# Altium project Notch-Filter-1.PrjPcb
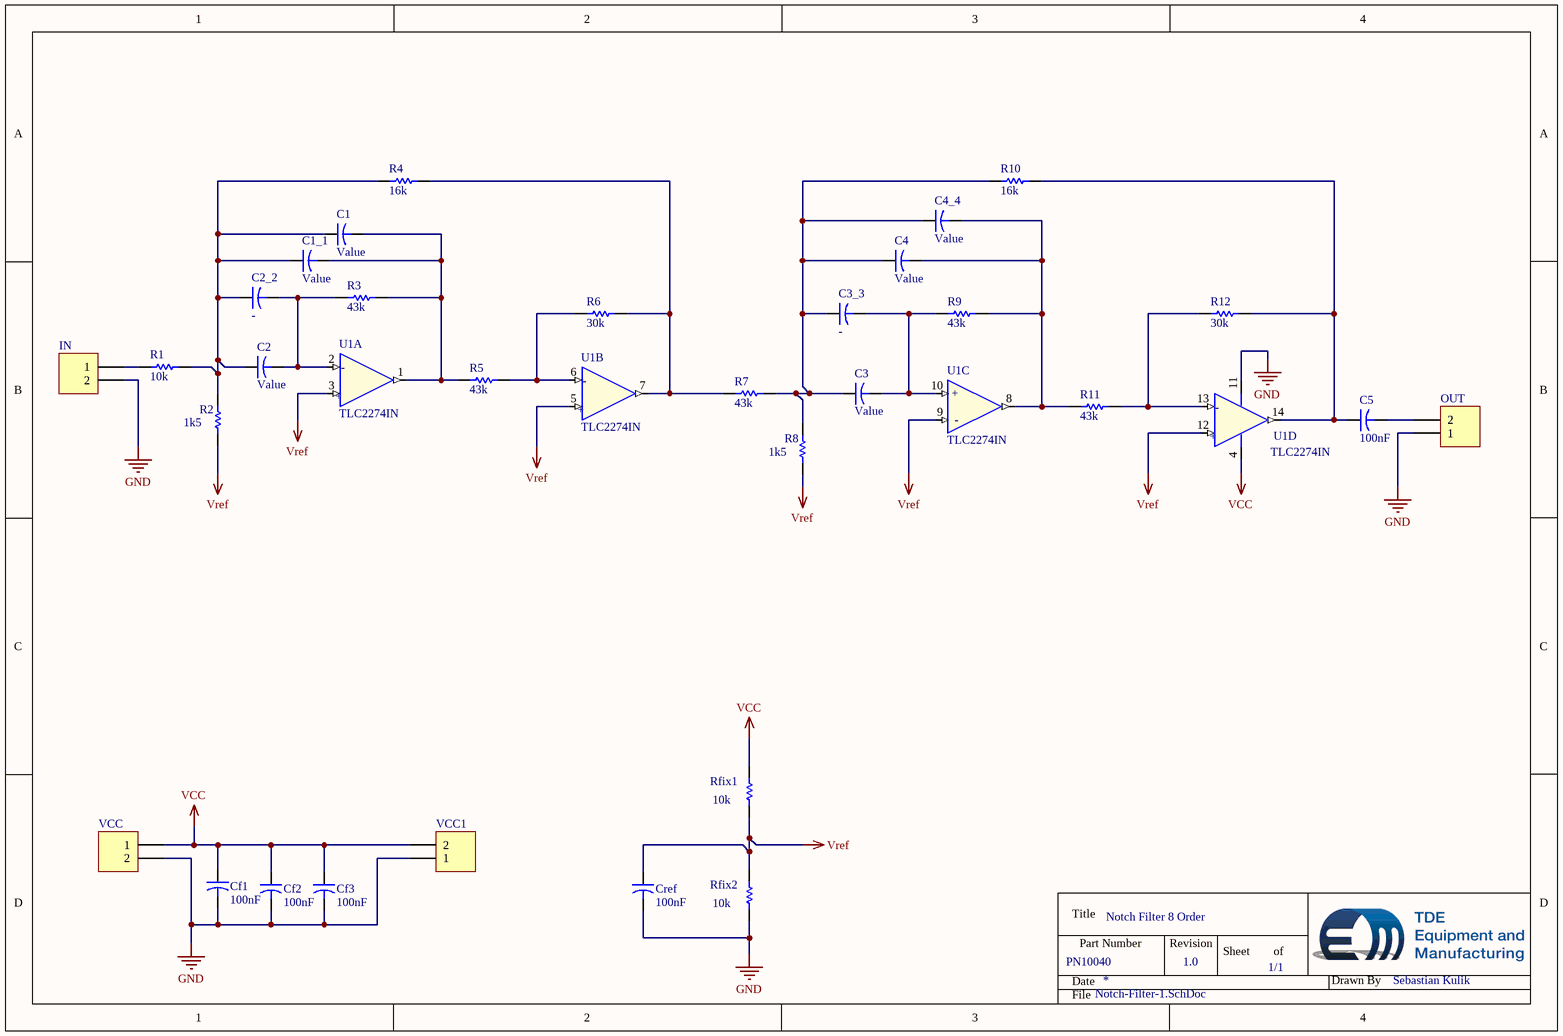
[diagram p0: Notch-Filter-1.SchDoc]
1 sheet, 32 parts. Net scope: global (net labels, ports and power ports of the same name join across sheets).
Board file: Notch-Filter-1.PcbDoc

## Sheet Notch-Filter-1.SchDoc: Notch Filter 8 Order
size A4; PartNumber: PN10040; Drawn By: Sebastian Kulik

### Parts
C1  Capacitor-Dummy-THT  [Dummy-10mm]  (value not drawn)
C1_1  Capacitor-Dummy-THT  [Dummy-10mm]  (value not drawn)
C2  Capacitor-Dummy-THT  [Dummy-10mm]  (value not drawn)
C2_2  Capacitor-Dummy-THT  [Dummy-10mm]  (value not drawn)
C3  Capacitor-Dummy-THT  [Dummy-10mm]  (value not drawn)
C3_3  Capacitor-Dummy-THT  [Dummy-10mm]  (value not drawn)
C4  Capacitor-Dummy-THT  [Dummy-10mm]  (value not drawn)
C4_4  Capacitor-Dummy-THT  [Dummy-10mm]  (value not drawn)
C5  value 100nF  [Dummy-10mm]  (hidden comment: Capacitor-Dummy-THT)
Cf1  value 100nF  [Dummy-10mm]  (hidden comment: Capacitor-Dummy-THT)
Cf2  value 100nF  [Dummy-10mm]  (hidden comment: Capacitor-Dummy-THT)
Cf3  value 100nF  [Dummy-10mm]  (hidden comment: Capacitor-Dummy-THT)
Cref  value 100nF  [Dummy-10mm]  (hidden comment: Capacitor-Dummy-THT)
IN  PHOENIX_1715721  [Phoenix-2-5_08]  (value not drawn)
OUT  PHOENIX_1715721  [Phoenix-2-5_08]  (value not drawn)
R1  value 10k  [Dummy-10mm]  (hidden comment: Resistor-Dummy-THT)
R2  value 1k5  [Dummy-10mm]  (hidden comment: Resistor-Dummy-THT)
R3  value 43k  [Dummy-10mm]  (hidden comment: Resistor-Dummy-THT)
R4  value 16k  [Dummy-10mm]  (hidden comment: Resistor-Dummy-THT)
R5  value 43k  [Dummy-10mm]  (hidden comment: Resistor-Dummy-THT)
R6  value 30k  [Dummy-10mm]  (hidden comment: Resistor-Dummy-THT)
R7  value 43k  [Dummy-10mm]  (hidden comment: Resistor-Dummy-THT)
R8  value 1k5  [Dummy-10mm]  (hidden comment: Resistor-Dummy-THT)
R9  value 43k  [Dummy-10mm]  (hidden comment: Resistor-Dummy-THT)
R10  value 16k  [Dummy-10mm]  (hidden comment: Resistor-Dummy-THT)
R11  value 43k  [Dummy-10mm]  (hidden comment: Resistor-Dummy-THT)
R12  value 30k  [Dummy-10mm]  (hidden comment: Resistor-Dummy-THT)
Rfix1  value 10k  [Dummy-10mm]  (hidden comment: Resistor-Dummy-THT)
Rfix2  value 10k  [Dummy-10mm]  (hidden comment: Resistor-Dummy-THT)
U1  TLC2274IN  [DIP-14]  (parts A,B,C,D of 4)
VCC  PHOENIX_1715721  [Phoenix-2-5_08]  (value not drawn)
VCC1  PHOENIX_1715721  [Phoenix-2-5_08]  (value not drawn)

### Nets
GND: Cf1.2 Cf2.2 Cf3.2 Cref.2 IN.2 OUT.1 Rfix2.1 U1.11(V-) VCC.2 VCC1.1
VCC: Cf1.1 Cf2.1 Cf3.1 Rfix1.2 U1.4(V+) VCC.1 VCC1.2
Vref: Cref.1 R2.1 R8.1 Rfix1.1 Rfix2.2 U1.3(IN-) U1.5(IN-) U1.9(IN+) U1.12(IN-)
NetC1_1: C1.1 C1_1.1 C2.1 C2_2.1 R1.1 R2.2 R4.2
NetC1_2: C1.2 C1_1.2 R3.2 R5.1 U1.1(OUT)
NetC2_2: C2.2 C2_2.2 R3.1 U1.2(IN+)
NetC3_1: C3.1 C3_3.1 C4.1 C4_4.1 R7.1 R8.2 R10.2
NetC3_2: C3.2 C3_3.2 R9.2 U1.10(IN-)
NetC4_2: C4.2 C4_4.2 R9.1 R11.2 U1.8(OUT)
NetC5_1: C5.1 R10.1 R12.1 U1.14(OUT)
NetC5_2: C5.2 OUT.2
NetIN_1: IN.1 R1.2
NetR4_1: R4.1 R6.2 R7.2 U1.7(OUT)
NetR5_2: R5.2 R6.1 U1.6(IN+)
NetR11_1: R11.1 R12.2 U1.13(IN+)

### Notes on the sheet
- 1.0
- 1/1
- Title
- Date
- Part Number
- Revision
- Sheet
- of
- Drawn By
- File
- (in symbol TLC2274IN, part A) -; +
- (in symbol TLC2274IN, part B) -; +
- (in symbol TLC2274IN, part C) +; -
- (in symbol TLC2274IN, part D) -; +

### Library data of the parts
C5 Cf1-Cf3 Cref = Capacitor-Dummy-THT: Deliverer PartNr: 537-3707; Deliverer: RS; Published: 08.12.2015; Part Description: Capacitor-Dummy-THT; Publisher: Sebastian Kulik; PackageDescription: -; Manufacturer: -; Manufacturer PartNr: -; TDE-PN: -
IN OUT VCC VCC1 = 2Pol_1715721: Phoenix, 2 pol, 5.08mm, 22A, 715721; Deliverer PartNr: 193-0564; Deliverer: RS; TDE-PN: CON0008; LatestRevisionDate: 02.05.2014; LatestRevisionNote: Re-released for DXP Platform.; Publisher: Sebastian Kulik; Manufacturer PartNr: 1715721; Manufacturer: Phoenix; PackageDescription: Phoenix-2-5_08
R1 Rfix1 Rfix2 = Resistor-Dummy-THT: Deliverer PartNr: 148-736; Deliverer: RS; Published: 08.12.2015; Publisher: Sebastian Kulik; PackageDescription: -; Manufacturer: -; Manufacturer PartNr: -; TDE-PN: -; Part Desicription: Resistor-Dummy-THT
R2 R8 = Resistor-Dummy-THT: Deliverer PartNr: 148-540; Deliverer: RS; Published: 08.12.2015; Publisher: Sebastian Kulik; PackageDescription: -; Manufacturer: -; Manufacturer PartNr: -; TDE-PN: -; Part Desicription: Resistor-Dummy-THT
R3 R5 R7 R9 R11 = Resistor-Dummy-THT: Deliverer PartNr: 683-3695; Deliverer: RS; Published: 08.12.2015; Publisher: Sebastian Kulik; PackageDescription: -; Manufacturer: -; Manufacturer PartNr: -; TDE-PN: -; Part Desicription: Resistor-Dummy-THT
R4 R10 = Resistor-Dummy-THT: Deliverer PartNr: 683-3099; Deliverer: RS; Published: 08.12.2015; Publisher: Sebastian Kulik; PackageDescription: -; Manufacturer: -; Manufacturer PartNr: -; TDE-PN: -; Part Desicription: Resistor-Dummy-THT
R6 R12 = Resistor-Dummy-THT: Deliverer PartNr: 506-5383; Deliverer: RS; Published: 08.12.2015; Publisher: Sebastian Kulik; PackageDescription: -; Manufacturer: -; Manufacturer PartNr: -; TDE-PN: -; Part Desicription: Resistor-Dummy-THT
U1 = TLC2274IN: Reel to Reel  quad OP; Deliverer PartNr: 331-2182; Manufacturer: TI; Deliverer: RS; TDE-PN: IC0072; Published: 28.03.2014; PackageDescription: TSSOP8; Publisher: Sebastian Kulik; Manufacturer PartNr: TLC2274IN
C1 C1_1 C2 C2_2 C3 C3_3 C4 C4_4 = Capacitor-Dummy-THT: Published: 08.12.2015; Part Description: Capacitor-Dummy-THT; Publisher: Sebastian Kulik; PackageDescription: -; Deliverer: -; Deliverer PartNr: -; Manufacturer: -; Manufacturer PartNr: -; TDE-PN: -
  C1 C1_1 C2-C4 C4_4: Value: Value
  C2_2 C3_3: Value: -

## Assembly variants
Notch-Filter-100kHz: not fitted C1_1 C2_2 C3_3 C4_4; alternate parts C1 -> Capacitor-Dummy-THT, C2 -> Capacitor-Dummy-THT, C3 -> Capacitor-Dummy-THT, C4 -> Capacitor-Dummy-THT
Notch-Filter-200kHz: not fitted C1_1 C2_2 C3_3 C4_4; alternate parts C1 -> Capacitor-Dummy-THT, C2 -> Capacitor-Dummy-THT, C3 -> Capacitor-Dummy-THT, C4 -> Capacitor-Dummy-THT
Notch-Filter-400kHz: alternate parts C1 -> Capacitor-Dummy-THT, C1_1 -> Capacitor-Dummy-THT, C2 -> Capacitor-Dummy-THT, C2_2 -> Capacitor-Dummy-THT, C3 -> Capacitor-Dummy-THT, C3_3 -> Capacitor-Dummy-THT, C4 -> Capacitor-Dummy-THT, C4_4 -> Capacitor-Dummy-THT
Notch-Filter-500kHz: not fitted C1_1 C2_2 C3_3 C4_4; alternate parts C1 -> Capacitor-Dummy-THT, C2 -> Capacitor-Dummy-THT, C3 -> Capacitor-Dummy-THT, C4 -> Capacitor-Dummy-THT
Notch-Filter-600kHz: not fitted C1_1 C2_2 C3_3 C4_4; alternate parts C1 -> Capacitor-Dummy-THT, C2 -> Capacitor-Dummy-THT, C3 -> Capacitor-Dummy-THT, C4 -> Capacitor-Dummy-THT
Notch-Filter-800kHz: alternate parts C1 -> Capacitor-Dummy-THT, C1_1 -> Capacitor-Dummy-THT, C2 -> Capacitor-Dummy-THT, C2_2 -> Capacitor-Dummy-THT, C3 -> Capacitor-Dummy-THT, C3_3 -> Capacitor-Dummy-THT, C4 -> Capacitor-Dummy-THT, C4_4 -> Capacitor-Dummy-THT